# EAGLE schematic LinuxBoard_v1.2 (EAGLE 7.2.0)
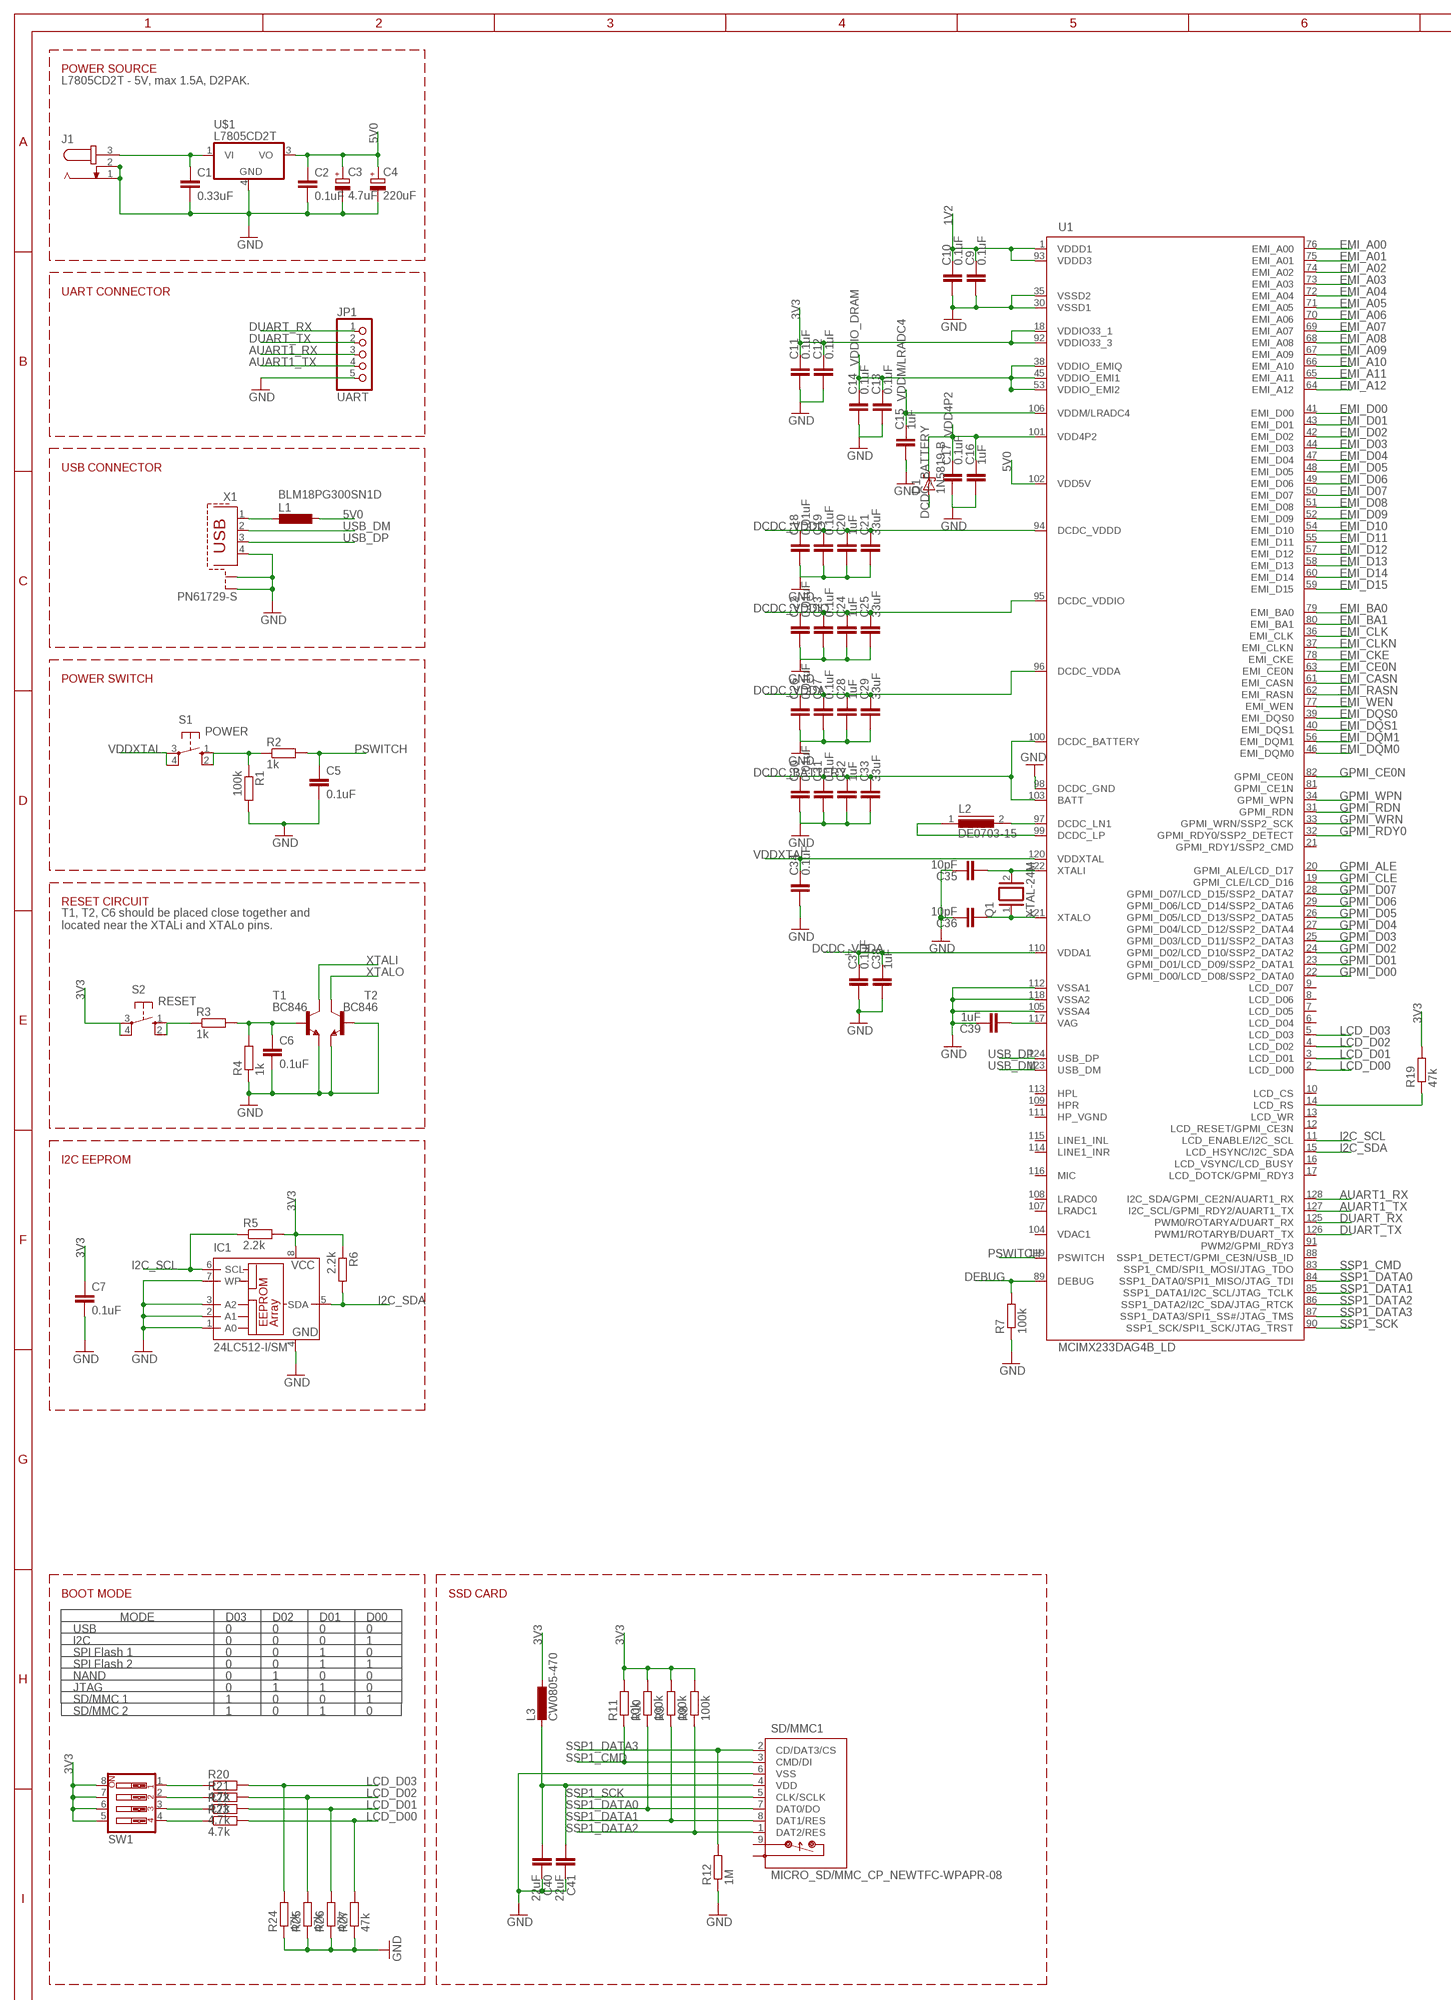
[diagram p0: schematic, sheet 1, part 1 of 2]
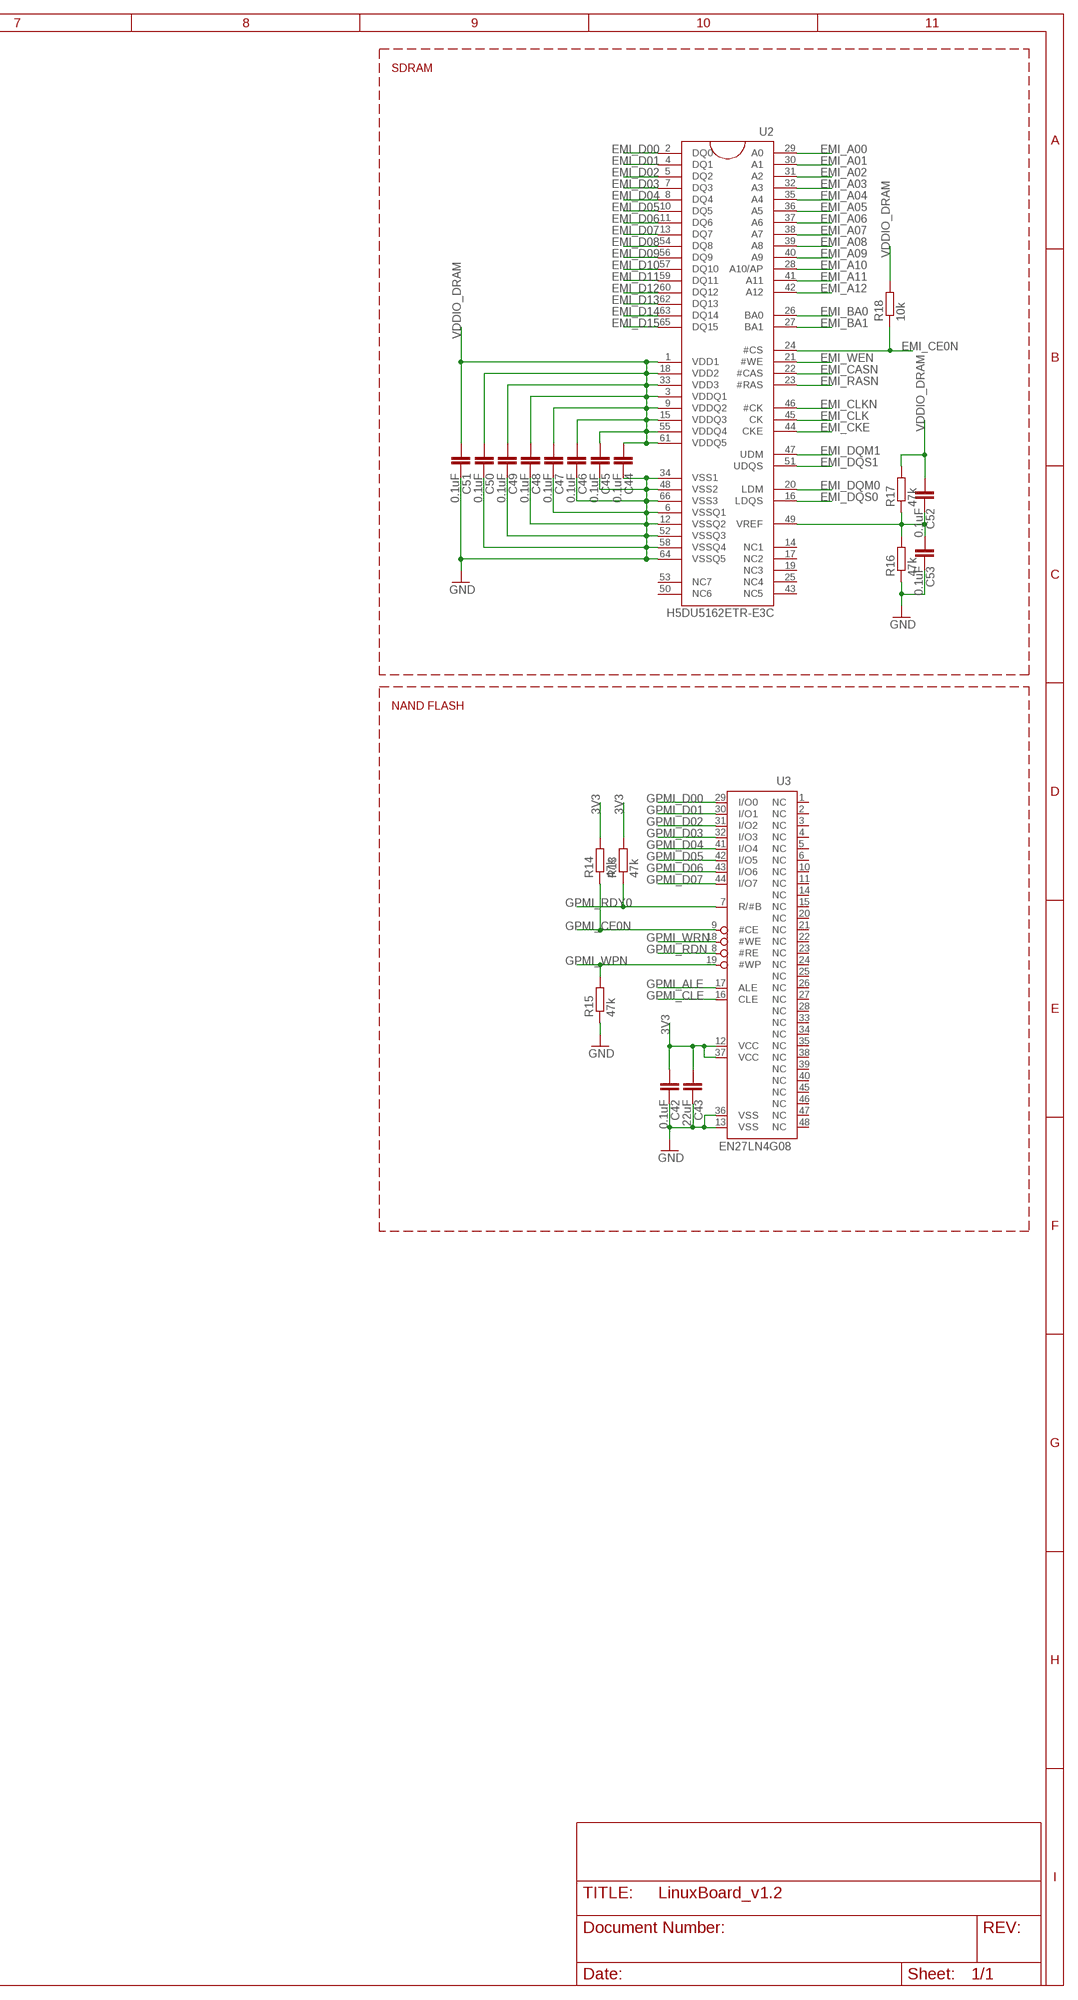
[diagram p1: schematic, sheet 1, part 2 of 2]

## Parts
C1  0.33uF  C-EUC0805  [C0805]
C2  0.1uF  C-EUC0805  [C0805]
C3  4.7uF  CPOL-EUE2-5  [E2-5]
C4  220uF  CPOL-EUE2-5  [E2-5]
C5  0.1uF  C-EUC0805  [C0805]
C6  0.1uF  C-EUC0805  [C0805]
C7  0.1uF  C-EUC0805  [C0805]
C9  0.1uF  C-EUC0805  [C0805]
C10  0.1uF  C-EUC0805  [C0805]
C11  0.1uF  C-EUC0805  [C0805]
C12  0.1uF  C-EUC0805  [C0805]
C13  0.1uF  C-EUC0805  [C0805]
C14  0.1uF  C-EUC0805  [C0805]
C15  1uF  C-EUC0805  [C0805]
C16  1uF  C-EUC0805  [C0805]
C17  0.1uF  C-EUC0805  [C0805]
C18  0.01uF  C-EUC0805  [C0805]
C19  0.1uF  C-EUC0805  [C0805]
C20  1uF  C-EUC0805  [C0805]
C21  33uF  C-EUC0805  [C0805]
C22  0.01uF  C-EUC0805  [C0805]
C23  0.1uF  C-EUC0805  [C0805]
C24  1uF  C-EUC0805  [C0805]
C25  33uF  C-EUC0805  [C0805]
C26  0.01uF  C-EUC0805  [C0805]
C27  0.1uF  C-EUC0805  [C0805]
C28  1uF  C-EUC0805  [C0805]
C29  33uF  C-EUC0805  [C0805]
C30  0.01uF  C-EUC0805  [C0805]
C31  0.1uF  C-EUC0805  [C0805]
C32  1uF  C-EUC0805  [C0805]
C33  33uF  C-EUC0805  [C0805]
C34  0.1uF  C-EUC0805  [C0805]
C35  10pF  C-EUC0805  [C0805]
C36  10pF  C-EUC0805  [C0805]
C37  0.1uF  C-EUC0805  [C0805]
C38  1uF  C-EUC0805  [C0805]
C39  1uF  C-EUC0805  [C0805]
C40  22uF  C-EUC0805  [C0805]
C41  22uF  C-EUC0805  [C0805]
C42  0.1uF  C-EUC0805  [C0805]
C43  22uF  C-EUC0805  [C0805]
C44  0.1uF  C-EUC0805  [C0805]
C45  0.1uF  C-EUC0805  [C0805]
C46  0.1uF  C-EUC0805  [C0805]
C47  0.1uF  C-EUC0805  [C0805]
C48  0.1uF  C-EUC0805  [C0805]
C49  0.1uF  C-EUC0805  [C0805]
C50  0.1uF  C-EUC0805  [C0805]
C51  0.1uF  C-EUC0805  [C0805]
C52  0.1uF  C-EUC0805  [C0805]
C53  0.1uF  C-EUC0805  [C0805]
D1  1N5819-B  [DO41-7.6]
IC1  24LC512-I/SM  24LC128SN  [SO-08]
J1  JACK-PLUG0  [SPC4077]
JP1  UART  PINHD-1X5  [1X05]
L1  BLM18PG300SN1D  L-EUL0201  [L0201]
L2  DE0703-15  DR73  [DR73]
L3  CW0805-470  L-EUL2012C  [L2012C]
Q1  XTAL-24M  XTAL/S  [QS]
R1  100k  R-EU_R0805  [R0805]
R2  1k  R-EU_R0805  [R0805]
R3  1k  R-EU_R0805  [R0805]
R4  1k  R-EU_R0805  [R0805]
R5  2.2k  R-EU_R0805  [R0805]
R6  2.2k  R-EU_R0805  [R0805]
R7  100k  R-EU_R0805  [R0805]
R8  100k  R-EU_R0805  [R0805]
R9  100k  R-EU_R0805  [R0805]
R10  100k  R-EU_R0805  [R0805]
R11  10k  R-EU_R0805  [R0805]
R12  1M  R-EU_R0805  [R0805]
R13  47k  R-EU_R0805  [R0805]
R14  47k  R-EU_R0805  [R0805]
R15  47k  R-EU_R0805  [R0805]
R16  47k  R-EU_R0805  [R0805]
R17  47k  R-EU_R0805  [R0805]
R18  10k  R-EU_R0805  [R0805]
R19  47k  R-EU_R0805  [R0805]
R20  4.7k  R-EU_R0805  [R0805]
R21  4.7k  R-EU_R0805  [R0805]
R22  4.7k  R-EU_R0805  [R0805]
R23  4.7k  R-EU_R0805  [R0805]
R24  47k  R-EU_R0805  [R0805]
R25  47k  R-EU_R0805  [R0805]
R26  47k  R-EU_R0805  [R0805]
R27  47k  R-EU_R0805  [R0805]
S1  POWER  10-XX  [B3F-10XX]
S2  RESET  10-XX  [B3F-10XX]
SD/MMC1  MICRO_SD/MMC_CP_NEWTFC-WPAPR-08  [TFC-WPAPR-08]
SW1  SW_DIP-4  [EDG-04]
T1  BC846  [SOT23]
T2  BC846  [SOT23]
U1  MCIMX233DAG4B_LD  [TQFP128LD]
U2  H5DU5162ETR-E3C  HY5DU121622D(L)T(P)-J  [66TSOP-II]
U3  EN27LN4G08  H27UBG8T2A  [TSOP48]
U$1  L7805CD2T  [D2PAK-3]
X1  PN61729-S  [PN61729-S]

## Nets
1V2: C9.1 C10.1 U1.1(VDDD1) U1.93(VDDD3)
3V3: C7.1 C11.1 C12.1 C42.2 C43.2 IC1.8(VCC) L3.1 R5.2 R6.1 R8.2 R9.2 R10.2 R11.2 R13.2 R14.2 R19.2 S2.3(P) S2.4(P1) SW1.5 SW1.6 SW1.7 SW1.8 U1.18(VDDIO33_1) U1.92(VDDIO33_3) U3.12(VCC) U3.37(VCC)
5V0: C2.1 C3.+ C4.+ L1.1 U1.102(VDD5V) U$1.3(VO)
AUART1_RX: JP1.3 U1.128(I2C_SDA/GPMI_CE2N/AUART1_RX)
AUART1_TX: JP1.4 U1.127(I2C_SCL/GPMI_RDY2/AUART1_TX)
DCDC_BATTERY: C30.1 C31.1 C32.1 C33.1 D1.A U1.100(DCDC_BATTERY) U1.103(BATT)
DCDC_VDDA: C26.1 C27.1 C28.1 C29.1 C37.1 C38.1 U1.96(DCDC_VDDA) U1.110(VDDA1)
DCDC_VDDD: C18.1 C19.1 C20.1 C21.1 U1.94(DCDC_VDDD)
DCDC_VDDIO: C22.1 C23.1 C24.1 C25.1 U1.95(DCDC_VDDIO)
DEBUG: R7.2 U1.89(DEBUG)
DUART_RX: JP1.1 U1.125(PWM0/ROTARYA/DUART_RX)
DUART_TX: JP1.2 U1.126(PWM1/ROTARYB/DUART_TX)
EMI_A00: U1.76(EMI_A00) U2.29(A0)
EMI_A01: U1.75(EMI_A01) U2.30(A1)
EMI_A02: U1.74(EMI_A02) U2.31(A2)
EMI_A03: U1.73(EMI_A03) U2.32(A3)
EMI_A04: U1.72(EMI_A04) U2.35(A4)
EMI_A05: U1.71(EMI_A05) U2.36(A5)
EMI_A06: U1.70(EMI_A06) U2.37(A6)
EMI_A07: U1.69(EMI_A07) U2.38(A7)
EMI_A08: U1.68(EMI_A08) U2.39(A8)
EMI_A09: U1.67(EMI_A09) U2.40(A9)
EMI_A10: U1.66(EMI_A10) U2.28(A10/AP)
EMI_A11: U1.65(EMI_A11) U2.41(A11)
EMI_A12: U1.64(EMI_A12) U2.42(A12)
EMI_BA0: U1.79(EMI_BA0) U2.26(BA0)
EMI_BA1: U1.80(EMI_BA1) U2.27(BA1)
EMI_CASN: U1.61(EMI_CASN) U2.22(#CAS)
EMI_CE0N: R18.1 U1.63(EMI_CE0N) U2.24(#CS)
EMI_CKE: U1.78(EMI_CKE) U2.44(CKE)
EMI_CLK: U1.36(EMI_CLK) U2.45(CK)
EMI_CLKN: U1.37(EMI_CLKN) U2.46(#CK)
EMI_D00: U1.41(EMI_D00) U2.2(DQ0)
EMI_D01: U1.43(EMI_D01) U2.4(DQ1)
EMI_D02: U1.42(EMI_D02) U2.5(DQ2)
EMI_D03: U1.44(EMI_D03) U2.7(DQ3)
EMI_D04: U1.47(EMI_D04) U2.8(DQ4)
EMI_D05: U1.48(EMI_D05) U2.10(DQ5)
EMI_D06: U1.49(EMI_D06) U2.11(DQ6)
EMI_D07: U1.50(EMI_D07) U2.13(DQ7)
EMI_D08: U1.51(EMI_D08) U2.54(DQ8)
EMI_D09: U1.52(EMI_D09) U2.56(DQ9)
EMI_D10: U1.54(EMI_D10) U2.57(DQ10)
EMI_D11: U1.55(EMI_D11) U2.59(DQ11)
EMI_D12: U1.57(EMI_D12) U2.60(DQ12)
EMI_D13: U1.58(EMI_D13) U2.62(DQ13)
EMI_D14: U1.60(EMI_D14) U2.63(DQ14)
EMI_D15: U1.59(EMI_D15) U2.65(DQ15)
EMI_DQM0: U1.46(EMI_DQM0) U2.20(LDM)
EMI_DQM1: U1.56(EMI_DQM1) U2.47(UDM)
EMI_DQS0: U1.39(EMI_DQS0) U2.16(LDQS)
EMI_DQS1: U1.40(EMI_DQS1) U2.51(UDQS)
EMI_RASN: U1.62(EMI_RASN) U2.23(#RAS)
EMI_WEN: U1.77(EMI_WEN) U2.21(#WE)
GND: C1.2 C2.2 C3.- C4.- C5.2 C6.2 C7.2 C9.2 C10.2 C11.2 C12.2 C13.2 C14.2 C15.2 C16.2 C17.2 C18.2 C19.2 C20.2 C21.2 C22.2 C23.2 C24.2 C25.2 C26.2 C27.2 C28.2 C29.2 C30.2 C31.2 C32.2 C33.2 C34.2 C35.1 C36.1 C37.2 C38.2 C39.1 C40.1 C41.1 C42.1 C43.1 C44.1 C45.1 C46.1 C47.1 C48.1 C49.1 C50.1 C51.1 C53.1 IC1.1(A0) IC1.2(A1) IC1.3(A2) IC1.4(GND) IC1.7(WP) J1.1 J1.2 JP1.5 R1.2 R4.1 R7.1 R12.1 R15.1 R16.1 R24.1 R25.1 R26.1 R27.1 SD/MMC1.6(VSS) T1.2(E) T2.1(B) T2.2(E) U1.30(VSSD1) U1.35(VSSD2) U1.98(DCDC_GND) U1.105(VSSA4) U1.112(VSSA1) U1.118(VSSA2) U2.6(VSSQ1) U2.12(VSSQ2) U2.34(VSS1) U2.48(VSS2) U2.52(VSSQ3) U2.58(VSSQ4) U2.64(VSSQ5) U2.66(VSS3) U3.13(VSS) U3.36(VSS) U$1.4(GND) X1.4 X1.S1 X1.S2
GPMI_ALE: U1.20(GPMI_ALE/LCD_D17) U3.17(ALE)
GPMI_CE0N: R14.1 U1.82(GPMI_CE0N) U3.9(#CE)
GPMI_CLE: U1.19(GPMI_CLE/LCD_D16) U3.16(CLE)
GPMI_D00: U1.22(GPMI_D00/LCD_D08/SSP2_DATA0) U3.29(I/O0)
GPMI_D01: U1.23(GPMI_D01/LCD_D09/SSP2_DATA1) U3.30(I/O1)
GPMI_D02: U1.24(GPMI_D02/LCD_D10/SSP2_DATA2) U3.31(I/O2)
GPMI_D03: U1.25(GPMI_D03/LCD_D11/SSP2_DATA3) U3.32(I/O3)
GPMI_D04: U1.27(GPMI_D04/LCD_D12/SSP2_DATA4) U3.41(I/O4)
GPMI_D05: U1.26(GPMI_D05/LCD_D13/SSP2_DATA5) U3.42(I/O5)
GPMI_D06: U1.29(GPMI_D06/LCD_D14/SSP2_DATA6) U3.43(I/O6)
GPMI_D07: U1.28(GPMI_D07/LCD_D15/SSP2_DATA7) U3.44(I/O7)
GPMI_RDN: U1.31(GPMI_RDN) U3.8(#RE)
GPMI_RDY0: R13.1 U1.32(GPMI_RDY0/SSP2_DETECT) U3.7(R/#B)
GPMI_WPN: R15.2 U1.34(GPMI_WPN) U3.19(#WP)
GPMI_WRN: U1.33(GPMI_WRN/SSP2_SCK) U3.18(#WE)
I2C_SCL: IC1.6(SCL) R5.1 U1.11(LCD_ENABLE/I2C_SCL)
I2C_SDA: IC1.5(SDA) R6.2 U1.15(LCD_HSYNC/I2C_SDA)
LCD_D00: R23.2 R27.2 U1.2(LCD_D00)
LCD_D01: R22.2 R26.2 U1.3(LCD_D01)
LCD_D02: R21.2 R25.2 U1.4(LCD_D02)
LCD_D03: R20.2 R24.2 U1.5(LCD_D03)
N$1: C1.1 J1.3 U$1.1(VI)
N$2: R3.1 S2.1(S) S2.2(S1)
N$3: R1.1 R2.1 S1.1(S) S1.2(S1)
N$4: C6.1 R3.2 R4.2 T1.1(B)
N$5: R20.1 SW1.1
N$6: R21.1 SW1.2
N$7: R22.1 SW1.3
N$8: R23.1 SW1.4
N$9: L2.2 U1.97(DCDC_LN1)
N$10: L1.2 X1.1
N$11: L2.1 U1.99(DCDC_LP)
N$12: C39.2 U1.117(VAG)
N$13: R19.1 U1.14(LCD_RS)
N$16: C40.2 C41.2 L3.2 SD/MMC1.4(VDD)
N$26: C52.1 C53.2 R16.2 R17.1 U2.49(VREF)
PSWITCH: C5.1 R2.2 U1.119(PSWITCH)
SSP1_CMD: R11.1 SD/MMC1.3(CMD/DI) U1.83(SSP1_CMD/SPI1_MOSI/JTAG_TDO)
SSP1_DATA0: R10.1 SD/MMC1.7(DAT0/DO) U1.84(SSP1_DATA0/SPI1_MISO/JTAG_TDI)
SSP1_DATA1: R9.1 SD/MMC1.8(DAT1/RES) U1.85(SSP1_DATA1/I2C_SCL/JTAG_TCLK)
SSP1_DATA2: R8.1 SD/MMC1.1(DAT2/RES) U1.86(SSP1_DATA2/I2C_SDA/JTAG_RTCK)
SSP1_DATA3: R12.2 SD/MMC1.2(CD/DAT3/CS) U1.87(SSP1_DATA3/SPI1_SS#/JTAG_TMS)
SSP1_SCK: SD/MMC1.5(CLK/SCLK) U1.90(SSP1_SCK/SPI1_SCK/JTAG_TRST)
USB_DM: U1.123(USB_DM) X1.2
USB_DP: U1.124(USB_DP) X1.3
VDD4P2: C16.1 C17.1 D1.C U1.101(VDD4P2)
VDDIO_DRAM: C13.1 C14.1 C44.2 C45.2 C46.2 C47.2 C48.2 C49.2 C50.2 C51.2 C52.2 R17.2 R18.2 U1.38(VDDIO_EMIQ) U1.45(VDDIO_EMI1) U1.53(VDDIO_EMI2) U2.1(VDD1) U2.3(VDDQ1) U2.9(VDDQ2) U2.15(VDDQ3) U2.18(VDD2) U2.33(VDD3) U2.55(VDDQ4) U2.61(VDDQ5)
VDDM/LRADC4: C15.1 U1.106(VDDM/LRADC4)
VDDXTAL: C34.1 S1.3(P) S1.4(P1) U1.120(VDDXTAL)
XTALI: C35.2 Q1.2 T1.3(C) U1.122(XTALI)
XTALO: C36.2 Q1.1 T2.3(C) U1.121(XTALO)
Unconnected: SD/MMC1.9(CP_E) SD/MMC1.10(PACK1) U1.6(LCD_D04) U1.7(LCD_D05) U1.8(LCD_D06) U1.9(LCD_D07) U1.10(LCD_CS) U1.12(LCD_RESET/GPMI_CE3N) U1.13(LCD_WR) U1.16(LCD_VSYNC/LCD_BUSY) U1.17(LCD_DOTCK/GPMI_RDY3) U1.21(GPMI_RDY1/SSP2_CMD) U1.81(GPMI_CE1N) U1.88(SSP1_DETECT/GPMI_CE3N/USB_ID) U1.91(PWM2/GPMI_RDY3) U1.104(VDAC1) U1.107(LRADC1) U1.108(LRADC0) U1.109(HPR) U1.113(HPL) U1.114(LINE1_INR) U1.115(LINE1_INL) U1.116(MIC) U2.14(NC1) U2.17(NC2) U2.19(NC3) U2.25(NC4) U2.43(NC5) U2.50(NC6) U2.53(NC7) U3.1(NC) U3.2(NC) U3.3(NC) U3.4(NC) U3.5(NC) U3.6(NC) U3.10(NC) U3.11(NC) U3.14(NC) U3.15(NC) U3.20(NC) U3.21(NC) U3.22(NC) U3.23(NC) U3.24(NC) U3.25(NC) U3.26(NC) U3.27(NC) U3.28(NC) U3.33(NC) U3.34(NC) U3.35(NC) U3.38(NC) U3.39(NC) U3.40(NC) U3.45(NC) U3.46(NC) U3.47(NC) U3.48(NC)

## Notes on the sheet
- POWER SOURCE | SDRAM
- L7805CD2T - 5V, max 1.5A, D2PAK.
- UART CONNECTOR
- USB CONNECTOR
- POWER SWITCH
- NAND FLASH
- RESET CIRCUIT
- T1, T2, C6 should be placed close together and
  located near the XTALi and XTALo pins.
- I2C EEPROM
- BOOT MODE | SSD CARD
- MODE | D03 | D02 | D01 | D00
- USB | 0 | 0 | 0 | 0
- I2C | 0 | 0 | 0 | 1
- SPI Flash 1 | 0 | 0 | 1 | 0
- SPI Flash 2 | 0 | 0 | 1 | 1
- NAND | 0 | 1 | 0 | 0
- JTAG | 0 | 1 | 1 | 0
- SD/MMC 1 | 1 | 0 | 0 | 1
- SD/MMC 2 | 1 | 0 | 1 | 0

## Power pins joined to a net without a drawn wire
HP_VGND: U1.111(HP_VGND)

## Library data of the parts
C1 C2 C5-C7 C9-C53 = rcl:C-EU: CAPACITOR, European symbol
C3 C4 = rcl:CPOL-EU: POLARIZED CAPACITOR, European symbol
D1 = diode:1N581*: 1.0A SCHOTTKY BARRIER RECTIFIER Source: http://www.diodes.com/datasheets/ds23001.pdf
IC1 = microchip:24*: Serial EEPROM I2C; MF: MICROCHIP; MPN: 24LC128-I/SNG; OC_FARNELL: 9757937; OC_NEWARK: 30H1511
J1 = con-jack:JACK-PLUG: DC POWER JACK Power Jack, DC, Right Angle, Through Hole, Rated 5A at 16VDC, PC Terminals Distributor: Farnell (www.Farnell.de) Drawing: 84N1161.pdf / 84N1162.pdf Manufacturer: SPC Technology (www.spctechnology.com) Type: SPC4077 / SPC 4078; OC_FARNELL: unknown; OC_NEWARK: unknown
JP1 = pinhead:PINHD-1X5: PIN HEADER
L1 L3 = rcl:L-EU: INDUCTOR, European symbol
L2 = inductors:DR73: High Power Density, High Efficiency, Shielded Inductors Source: coiltronics_dr_series.pdf
Q1 = special:XTAL/S: CRYSTAL
R1-R27 = rcl:R-EU_: RESISTOR, European symbol
S1 S2 = switch-omron:10-XX: OMRON SWITCH; MPN: B3F-1000; OC_FARNELL: 176432; OC_NEWARK: 36M3542
SD/MMC1 = A13-OLinuXino_WIFI_Rev_G:MICRO_SD/MMC_CP_NEW
SW1 = special:SW_DIP-4: DIP SWITCH
T1 T2 = transistor:BC846: NPN TRANSISTOR
U1 = hosho:MCIMX233DAG4B: i.MX23
U2 = iMX233-OLinuXino-Micro_Rev_D:HY5DU121622D(L)T(P)
U3 = A13-OLinuXino_WIFI_Rev_G:H27UBG8T2A
U$1 = hosho:L7805CD2T
X1 = con-berg:PN61729-S: BERG USB connector; OC_FARNELL: unknown; OC_NEWARK: unknown

## Net classes
1 pwr: width 0.5 mm, clearance 0.2 mm